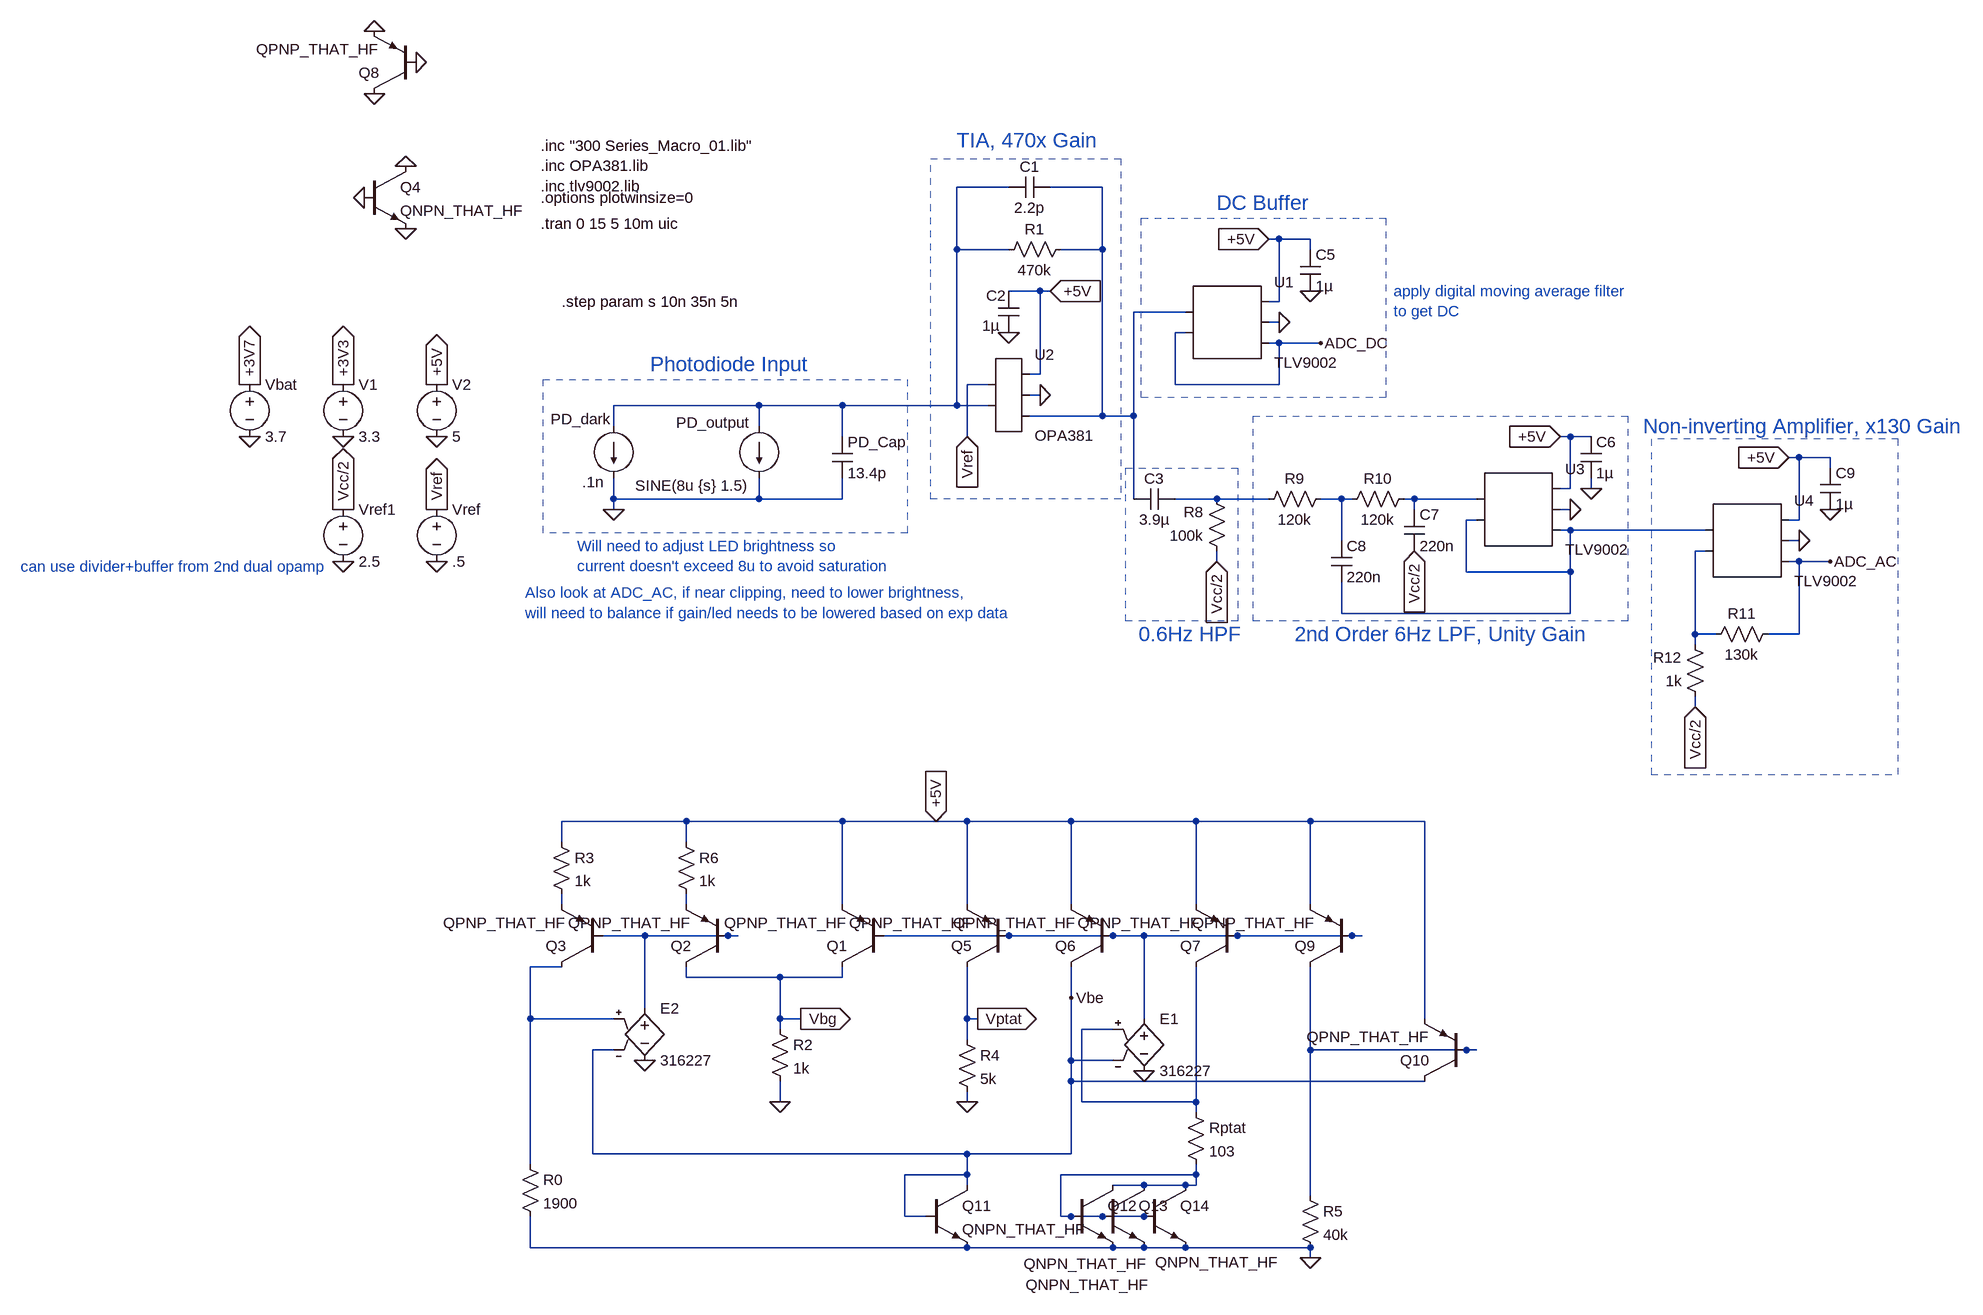
[diagram p0: schematic Capstone_AFE.asc]
Capstone_AFE.asc, the LTspice schematic file:
Version 4
SHEET 1 2676 1544
WIRE 1184 -160 1104 -160
WIRE 1328 -160 1248 -160
WIRE 1600 -80 1584 -80
WIRE 1648 -80 1600 -80
WIRE 1104 -64 1104 -160
WIRE 1184 -64 1104 -64
WIRE 1328 -64 1328 -160
WIRE 1328 -64 1264 -64
WIRE 1648 -64 1648 -80
WIRE 1232 0 1184 0
WIRE 1248 0 1232 0
WIRE 1600 16 1600 -80
WIRE 1600 16 1584 16
WIRE 1456 32 1376 32
WIRE 1600 48 1584 48
WIRE 1456 64 1440 64
WIRE 1600 80 1584 80
WIRE 1664 80 1600 80
WIRE 1232 128 1232 0
WIRE 1232 128 1216 128
WIRE 1152 144 1120 144
WIRE 1440 144 1440 64
WIRE 1600 144 1600 80
WIRE 1600 144 1440 144
WIRE 1232 160 1216 160
WIRE 800 176 576 176
WIRE 928 176 800 176
WIRE 1104 176 1104 -64
WIRE 1104 176 928 176
WIRE 1152 176 1104 176
WIRE 1328 192 1328 -64
WIRE 1328 192 1216 192
WIRE 1376 192 1376 32
WIRE 1376 192 1328 192
WIRE 576 208 576 176
WIRE 800 208 800 176
WIRE 928 224 928 176
WIRE 1120 224 1120 144
WIRE 2048 224 2032 224
WIRE 2080 224 2048 224
WIRE 2400 256 2384 256
WIRE 2448 256 2400 256
WIRE 2448 272 2448 256
WIRE 2048 304 2048 224
WIRE 2048 304 2032 304
WIRE 2080 304 2080 288
WIRE 576 320 576 288
WIRE 800 320 800 288
WIRE 800 320 576 320
WIRE 928 320 928 288
WIRE 928 320 800 320
WIRE 1376 320 1376 192
WIRE 1504 320 1440 320
WIRE 1584 320 1504 320
WIRE 1696 320 1664 320
WIRE 1712 320 1696 320
WIRE 1808 320 1792 320
WIRE 1904 320 1808 320
WIRE 576 336 576 320
WIRE 1808 336 1808 320
WIRE 2048 336 2032 336
WIRE 1904 352 1888 352
WIRE 2400 352 2400 256
WIRE 2400 352 2384 352
WIRE 2048 368 2032 368
WIRE 2256 368 2048 368
WIRE 1696 384 1696 320
WIRE 2400 384 2384 384
WIRE 2256 400 2240 400
WIRE 1504 416 1504 400
WIRE 2400 416 2384 416
WIRE 2448 416 2400 416
WIRE 1888 432 1888 352
WIRE 2048 432 2048 368
WIRE 2048 432 1888 432
WIRE 1696 496 1696 448
WIRE 2048 496 2048 432
WIRE 2048 496 1696 496
WIRE 2240 528 2240 400
WIRE 2272 528 2240 528
WIRE 2400 528 2400 416
WIRE 2400 528 2352 528
WIRE 2240 544 2240 528
WIRE 2240 640 2240 624
WIRE 688 816 496 816
WIRE 928 816 688 816
WIRE 1072 816 928 816
WIRE 1120 816 1072 816
WIRE 1280 816 1120 816
WIRE 1472 816 1280 816
WIRE 1648 816 1472 816
WIRE 1824 816 1648 816
WIRE 496 848 496 816
WIRE 688 848 688 816
WIRE 496 944 496 928
WIRE 688 944 688 928
WIRE 928 944 928 816
WIRE 1120 944 1120 816
WIRE 1280 944 1280 816
WIRE 1472 944 1472 816
WIRE 1648 944 1648 816
WIRE 624 992 560 992
WIRE 752 992 624 992
WIRE 768 992 752 992
WIRE 1184 992 992 992
WIRE 1344 992 1184 992
WIRE 1392 992 1344 992
WIRE 1536 992 1392 992
WIRE 1712 992 1536 992
WIRE 1728 992 1712 992
WIRE 496 1040 448 1040
WIRE 688 1056 688 1040
WIRE 832 1056 688 1056
WIRE 928 1056 928 1040
WIRE 928 1056 832 1056
WIRE 1280 1088 1280 1040
WIRE 624 1104 624 992
WIRE 448 1120 448 1040
WIRE 576 1120 448 1120
WIRE 832 1120 832 1056
WIRE 864 1120 832 1120
WIRE 1120 1120 1120 1040
WIRE 1136 1120 1120 1120
WIRE 1392 1120 1392 992
WIRE 1824 1120 1824 816
WIRE 832 1136 832 1120
WIRE 1344 1136 1296 1136
WIRE 1120 1152 1120 1120
WIRE 576 1168 544 1168
WIRE 1648 1168 1648 1040
WIRE 1888 1168 1648 1168
WIRE 1904 1168 1888 1168
WIRE 1280 1184 1280 1088
WIRE 1344 1184 1280 1184
WIRE 1280 1216 1280 1184
WIRE 1824 1216 1280 1216
WIRE 832 1248 832 1216
WIRE 1120 1248 1120 1232
WIRE 1296 1248 1296 1136
WIRE 1472 1248 1472 1040
WIRE 1472 1248 1296 1248
WIRE 1472 1264 1472 1248
WIRE 544 1328 544 1168
WIRE 1120 1328 544 1328
WIRE 1280 1328 1280 1216
WIRE 1280 1328 1120 1328
WIRE 448 1344 448 1120
WIRE 1120 1360 1120 1328
WIRE 1120 1360 1024 1360
WIRE 1472 1360 1472 1344
WIRE 1472 1360 1264 1360
WIRE 1120 1376 1120 1360
WIRE 1392 1376 1344 1376
WIRE 1456 1376 1392 1376
WIRE 1472 1376 1472 1360
WIRE 1472 1376 1456 1376
WIRE 1648 1392 1648 1168
WIRE 1024 1424 1024 1360
WIRE 1056 1424 1024 1424
WIRE 1264 1424 1264 1360
WIRE 1280 1424 1264 1424
WIRE 1328 1424 1280 1424
WIRE 1392 1424 1328 1424
WIRE 1408 1424 1392 1424
WIRE 448 1472 448 1424
WIRE 1120 1472 448 1472
WIRE 1344 1472 1120 1472
WIRE 1392 1472 1344 1472
WIRE 1456 1472 1392 1472
WIRE 1648 1472 1456 1472
WIRE 1648 1488 1648 1472
FLAG 304 224 0
FLAG 304 144 +5V
IOPIN 304 144 Out
FLAG 160 224 0
FLAG 160 144 +3V3
IOPIN 160 144 Out
FLAG 1072 816 +5V
IOPIN 1072 816 In
FLAG 1648 1488 0
FLAG 1136 1120 Vptat
IOPIN 1136 1120 Out
FLAG 1392 1200 0
FLAG 1120 1248 0
FLAG 208 -400 0
FLAG 272 -352 0
FLAG 208 -304 0
FLAG 256 -192 0
FLAG 192 -144 0
FLAG 256 -96 0
FLAG 1280 1088 Vbe
FLAG 16 224 0
FLAG 16 144 +3V7
IOPIN 16 144 Out
FLAG 624 1184 0
FLAG 832 1248 0
FLAG 864 1120 Vbg
IOPIN 864 1120 Out
FLAG 576 336 0
FLAG 304 416 0
FLAG 304 336 Vref
IOPIN 304 336 Out
FLAG 1120 224 Vref
IOPIN 1120 224 In
FLAG 1184 64 0
FLAG 1248 0 +5V
IOPIN 1248 0 In
FLAG 1232 160 0
FLAG 1504 416 Vcc/2
IOPIN 1504 416 In
FLAG 1648 0 0
FLAG 1584 -80 +5V
IOPIN 1584 -80 In
FLAG 1600 48 0
FLAG 160 416 0
FLAG 160 336 Vcc/2
IOPIN 160 336 Out
FLAG 1664 80 ADC_DC
FLAG 2080 304 0
FLAG 2032 224 +5V
IOPIN 2032 224 In
FLAG 2048 336 0
FLAG 1808 400 Vcc/2
IOPIN 1808 400 In
FLAG 2448 336 0
FLAG 2384 256 +5V
IOPIN 2384 256 In
FLAG 2400 384 0
FLAG 2240 640 Vcc/2
IOPIN 2240 640 In
FLAG 2448 416 ADC_AC
SYMBOL Voltage 304 128 R0
SYMATTR InstName V2
SYMATTR Value 5
SYMBOL Voltage 160 128 R0
SYMATTR InstName V1
SYMATTR Value 3.3
SYMBOL npn 192 -192 R0
SYMATTR InstName Q4
SYMATTR Value QNPN_THAT_HF
SYMBOL pnp 272 -304 R180
SYMATTR InstName Q8
SYMATTR Value QPNP_THAT_HF
SYMBOL pnp 1184 1040 R180
SYMATTR InstName Q5
SYMATTR Value QPNP_THAT_HF
SYMBOL pnp 1344 1040 R180
SYMATTR InstName Q6
SYMATTR Value QPNP_THAT_HF
SYMBOL pnp 1536 1040 R180
SYMATTR InstName Q7
SYMATTR Value QPNP_THAT_HF
SYMBOL pnp 1712 1040 R180
SYMATTR InstName Q9
SYMATTR Value QPNP_THAT_HF
SYMBOL pnp 1888 1216 R180
SYMATTR InstName Q10
SYMATTR Value QPNP_THAT_HF
SYMBOL npn 1056 1376 R0
SYMATTR InstName Q11
SYMATTR Value QNPN_THAT_HF
SYMBOL npn 1280 1376 R0
WINDOW 3 -73 121 Left 2
SYMATTR Value QNPN_THAT_HF
SYMATTR InstName Q12
SYMBOL npn 1328 1376 R0
WINDOW 3 -118 153 Left 2
SYMATTR Value QNPN_THAT_HF
SYMATTR InstName Q13
SYMBOL npn 1392 1376 R0
WINDOW 3 17 119 Left 2
SYMATTR Value QNPN_THAT_HF
SYMATTR InstName Q14
SYMBOL Res 1456 1248 R0
SYMATTR InstName Rptat
SYMATTR Value 103
SYMBOL Res 1632 1376 R0
SYMATTR InstName R5
SYMATTR Value 40k
SYMBOL e 1392 1104 R0
SYMATTR InstName E1
SYMATTR Value 316227
SYMBOL Res 1104 1136 R0
SYMATTR InstName R4
SYMATTR Value 5k
SYMBOL Voltage 16 128 R0
SYMATTR InstName Vbat
SYMATTR Value 3.7
SYMBOL e 624 1088 R0
SYMATTR InstName E2
SYMATTR Value 316227
SYMBOL pnp 992 1040 R180
SYMATTR InstName Q1
SYMATTR Value QPNP_THAT_HF
SYMBOL pnp 752 1040 R180
SYMATTR InstName Q2
SYMATTR Value QPNP_THAT_HF
SYMBOL pnp 560 1040 R180
SYMATTR InstName Q3
SYMATTR Value QPNP_THAT_HF
SYMBOL Res 432 1328 R0
SYMATTR InstName R0
SYMATTR Value 1900
SYMBOL Res 816 1120 R0
SYMATTR InstName R2
SYMATTR Value 1k
SYMBOL Res 480 832 R0
SYMATTR InstName R3
SYMATTR Value 1k
SYMBOL Res 672 832 R0
SYMATTR InstName R6
SYMATTR Value 1k
SYMBOL current 800 208 R0
WINDOW 0 -128 -6 Left 2
WINDOW 3 -191 91 Left 2
SYMATTR InstName PD_output
SYMATTR Value SINE(8u {s} 1.5)
SYMBOL current 576 208 R0
WINDOW 0 -97 -11 Left 2
WINDOW 3 -48 86 Left 2
SYMATTR InstName PD_dark
SYMATTR Value .1n
SYMBOL Cap 912 224 R0
SYMATTR InstName PD_Cap
SYMATTR Value 13.4p
SYMBOL Res 1280 -80 R90
WINDOW 0 0 56 VBottom 2
WINDOW 3 32 56 VTop 2
SYMATTR InstName R1
SYMATTR Value 470k
SYMBOL Cap 1248 -176 R90
WINDOW 0 0 32 VBottom 2
WINDOW 3 32 32 VTop 2
SYMATTR InstName C1
SYMATTR Value 2.2p
SYMBOL Voltage 304 320 R0
SYMATTR InstName Vref
SYMATTR Value .5
SYMBOL Cap 1168 0 R0
WINDOW 0 -19 7 Left 2
WINDOW 3 -25 53 Left 2
SYMATTR InstName C2
SYMATTR Value 1µ
SYMBOL AutoGenerated/OPA381 1184 160 R0
SYMATTR InstName U2
SYMBOL Res 1520 416 R180
WINDOW 0 36 76 Left 2
WINDOW 3 36 40 Left 2
SYMATTR InstName R8
SYMATTR Value 100k
SYMBOL Cap 1440 304 R90
WINDOW 0 0 32 VBottom 2
WINDOW 3 32 32 VTop 2
SYMATTR InstName C3
SYMATTR Value 3.9µ
SYMBOL Cap 1632 -64 R0
SYMATTR InstName C5
SYMATTR Value 1µ
SYMBOL AutoGenerated/TLV9002 1520 48 R0
SYMATTR InstName U1
SYMBOL Voltage 160 320 R0
SYMATTR InstName Vref1
SYMATTR Value 2.5
SYMBOL AutoGenerated/TLV9002 1968 336 R0
SYMATTR InstName U3
SYMBOL Cap 2064 224 R0
SYMATTR InstName C6
SYMATTR Value 1µ
SYMBOL Res 1680 304 R90
WINDOW 0 0 56 VBottom 2
WINDOW 3 32 56 VTop 2
SYMATTR InstName R9
SYMATTR Value 120k
SYMBOL Res 1808 304 R90
WINDOW 0 0 56 VBottom 2
WINDOW 3 32 56 VTop 2
SYMATTR InstName R10
SYMATTR Value 120k
SYMBOL Cap 1792 336 R0
SYMATTR InstName C7
SYMATTR Value 220n
SYMBOL Cap 1680 384 R0
SYMATTR InstName C8
SYMATTR Value 220n
SYMBOL Cap 2432 272 R0
SYMATTR InstName C9
SYMATTR Value 1µ
SYMBOL AutoGenerated/TLV9002 2320 384 R0
SYMATTR InstName U4
SYMBOL Res 2368 512 R90
WINDOW 0 0 56 VBottom 2
WINDOW 3 32 56 VTop 2
SYMATTR InstName R11
SYMATTR Value 130k
SYMBOL Res 2256 640 R180
WINDOW 0 36 76 Left 2
WINDOW 3 36 40 Left 2
SYMATTR InstName R12
SYMATTR Value 1k
TEXT 464 -224 Left 2 !.inc "300 Series_Macro_01.lib"\n.inc OPA381.lib\n.inc tlv9002.lib
TEXT 464 -104 Left 2 !.tran 0 15 5 10m uic
TEXT 464 -144 Left 2 !.options plotwinsize=0
TEXT 520 392 Left 2 ;Will need to adjust LED brightness so \ncurrent doesn't exceed 8u to avoid saturation
TEXT 1776 0 Left 2 ;apply digital moving average filter \nto get DC
TEXT 1384 528 Left 3 ;0.6Hz HPF
TEXT 1624 528 Left 3 ;2nd Order 6Hz LPF, Unity Gain
TEXT 2160 208 Left 3 ;Non-inverting Amplifier, x130 Gain
TEXT 1104 -232 Left 3 ;TIA, 470x Gain
TEXT 1504 -136 Left 3 ;DC Buffer
TEXT 632 112 Left 3 ;Photodiode Input
TEXT 496 16 Left 2 !.step param s 10n 35n 5n
TEXT 440 464 Left 2 ;Also look at ADC_AC, if near clipping, need to lower brightness,\nwill need to balance if gain/led needs to be lowered based on exp data
TEXT -336 424 Left 2 ;can use divider+buffer from 2nd dual opamp
RECTANGLE Normal 1064 -204 1356 320 2
RECTANGLE Normal 1388 -112 1764 164 2
RECTANGLE Normal 1560 192 2136 508 2
RECTANGLE Normal 2552 228 2172 744 2
RECTANGLE Normal 1364 272 1536 508 2
RECTANGLE Normal 468 136 1028 372 2

The netlist it stands for:
* Capstone_AFE.asc
V2 +5V 0 5
V1 +3V3 0 3.3
Q4 0 0 0 0 QNPN_THAT_HF
Q8 0 0 0 0 QPNP_THAT_HF
Q5 Vptat N011 +5V 0 QPNP_THAT_HF
Q6 Vbe N011 +5V 0 QPNP_THAT_HF
Q7 N013 N011 +5V 0 QPNP_THAT_HF
Q9 N014 N011 +5V 0 QPNP_THAT_HF
Q10 Vbe N014 +5V 0 QPNP_THAT_HF
Q11 Vbe Vbe 0 0 QNPN_THAT_HF
Q12 N015 N015 0 0 QNPN_THAT_HF
Q13 N015 N015 0 0 QNPN_THAT_HF
Q14 N015 N015 0 0 QNPN_THAT_HF
Rptat N013 N015 103
R5 N014 0 40k
E1 N011 0 N013 Vbe 316227
R4 Vptat 0 5k
Vbat +3V7 0 3.7
E2 N010 0 N012 Vbe 316227
Q1 Vbg N011 +5V 0 QPNP_THAT_HF
Q2 Vbg N010 N009 0 QPNP_THAT_HF
Q3 N012 N010 N008 0 QPNP_THAT_HF
R0 N012 0 1900
R2 Vbg 0 1k
R3 +5V N008 1k
R6 +5V N009 1k
I§PD_output N001 0 SINE(8u {s} 1.5)
I§PD_dark N001 0 .1n
C§PD_Cap N001 0 13.4p
R1 N002 N001 470k
C1 N002 N001 2.2p
Vref Vref 0 .5
C2 +5V 0 1µ
* U2: OPA381 (symbol AutoGenerated/OPA381 not available, pins judged from their places): pin1=Vref pin2=N001 pin3=+5V pin4=0 pin5=N002
R8 Vcc/2 N003 100k
C3 N003 N002 3.9µ
C5 +5V 0 1µ
* U1: TLV9002 (symbol AutoGenerated/TLV9002 not available, pins judged from their places): pin1=N002 pin2=ADC_DC pin3=+5V pin4=0 pin5=ADC_DC
Vref1 Vcc/2 0 2.5
* U3: TLV9002 (symbol AutoGenerated/TLV9002 not available, pins judged from their places): pin1=N005 pin2=N006 pin3=+5V pin4=0 pin5=N006
C6 +5V 0 1µ
R9 N004 N003 120k
R10 N005 N004 120k
C7 N005 Vcc/2 220n
C8 N004 N006 220n
C9 +5V 0 1µ
* U4: TLV9002 (symbol AutoGenerated/TLV9002 not available, pins judged from their places): pin1=N006 pin2=N007 pin3=+5V pin4=0 pin5=ADC_AC
R11 ADC_AC N007 130k
R12 Vcc/2 N007 1k
.model NPN NPN
.model PNP PNP
.lib standard.bjt
.inc "300 Series_Macro_01.lib"
.inc OPA381.lib
.inc tlv9002.lib
.tran 0 15 5 10m uic
.options plotwinsize=0
* Will need to adjust LED brightness so
* current doesn't exceed 8u to avoid saturation
* apply digital moving average filter
* to get DC
* 0.6Hz HPF
* 2nd Order 6Hz LPF, Unity Gain
* Non-inverting Amplifier, x130 Gain
* TIA, 470x Gain
* DC Buffer
* Photodiode Input
.step param s 10n 35n 5n
* Also look at ADC_AC, if near clipping, need to lower brightness,
* will need to balance if gain/led needs to be lowered based on exp data
* can use divider+buffer from 2nd dual opamp
.backanno
.end